# Altium schematic sheet STEP_MOTOR_DRIVER_2.SchDoc
size 420 x 297 mm; SheetNumber: 12; SheetTotal: 20
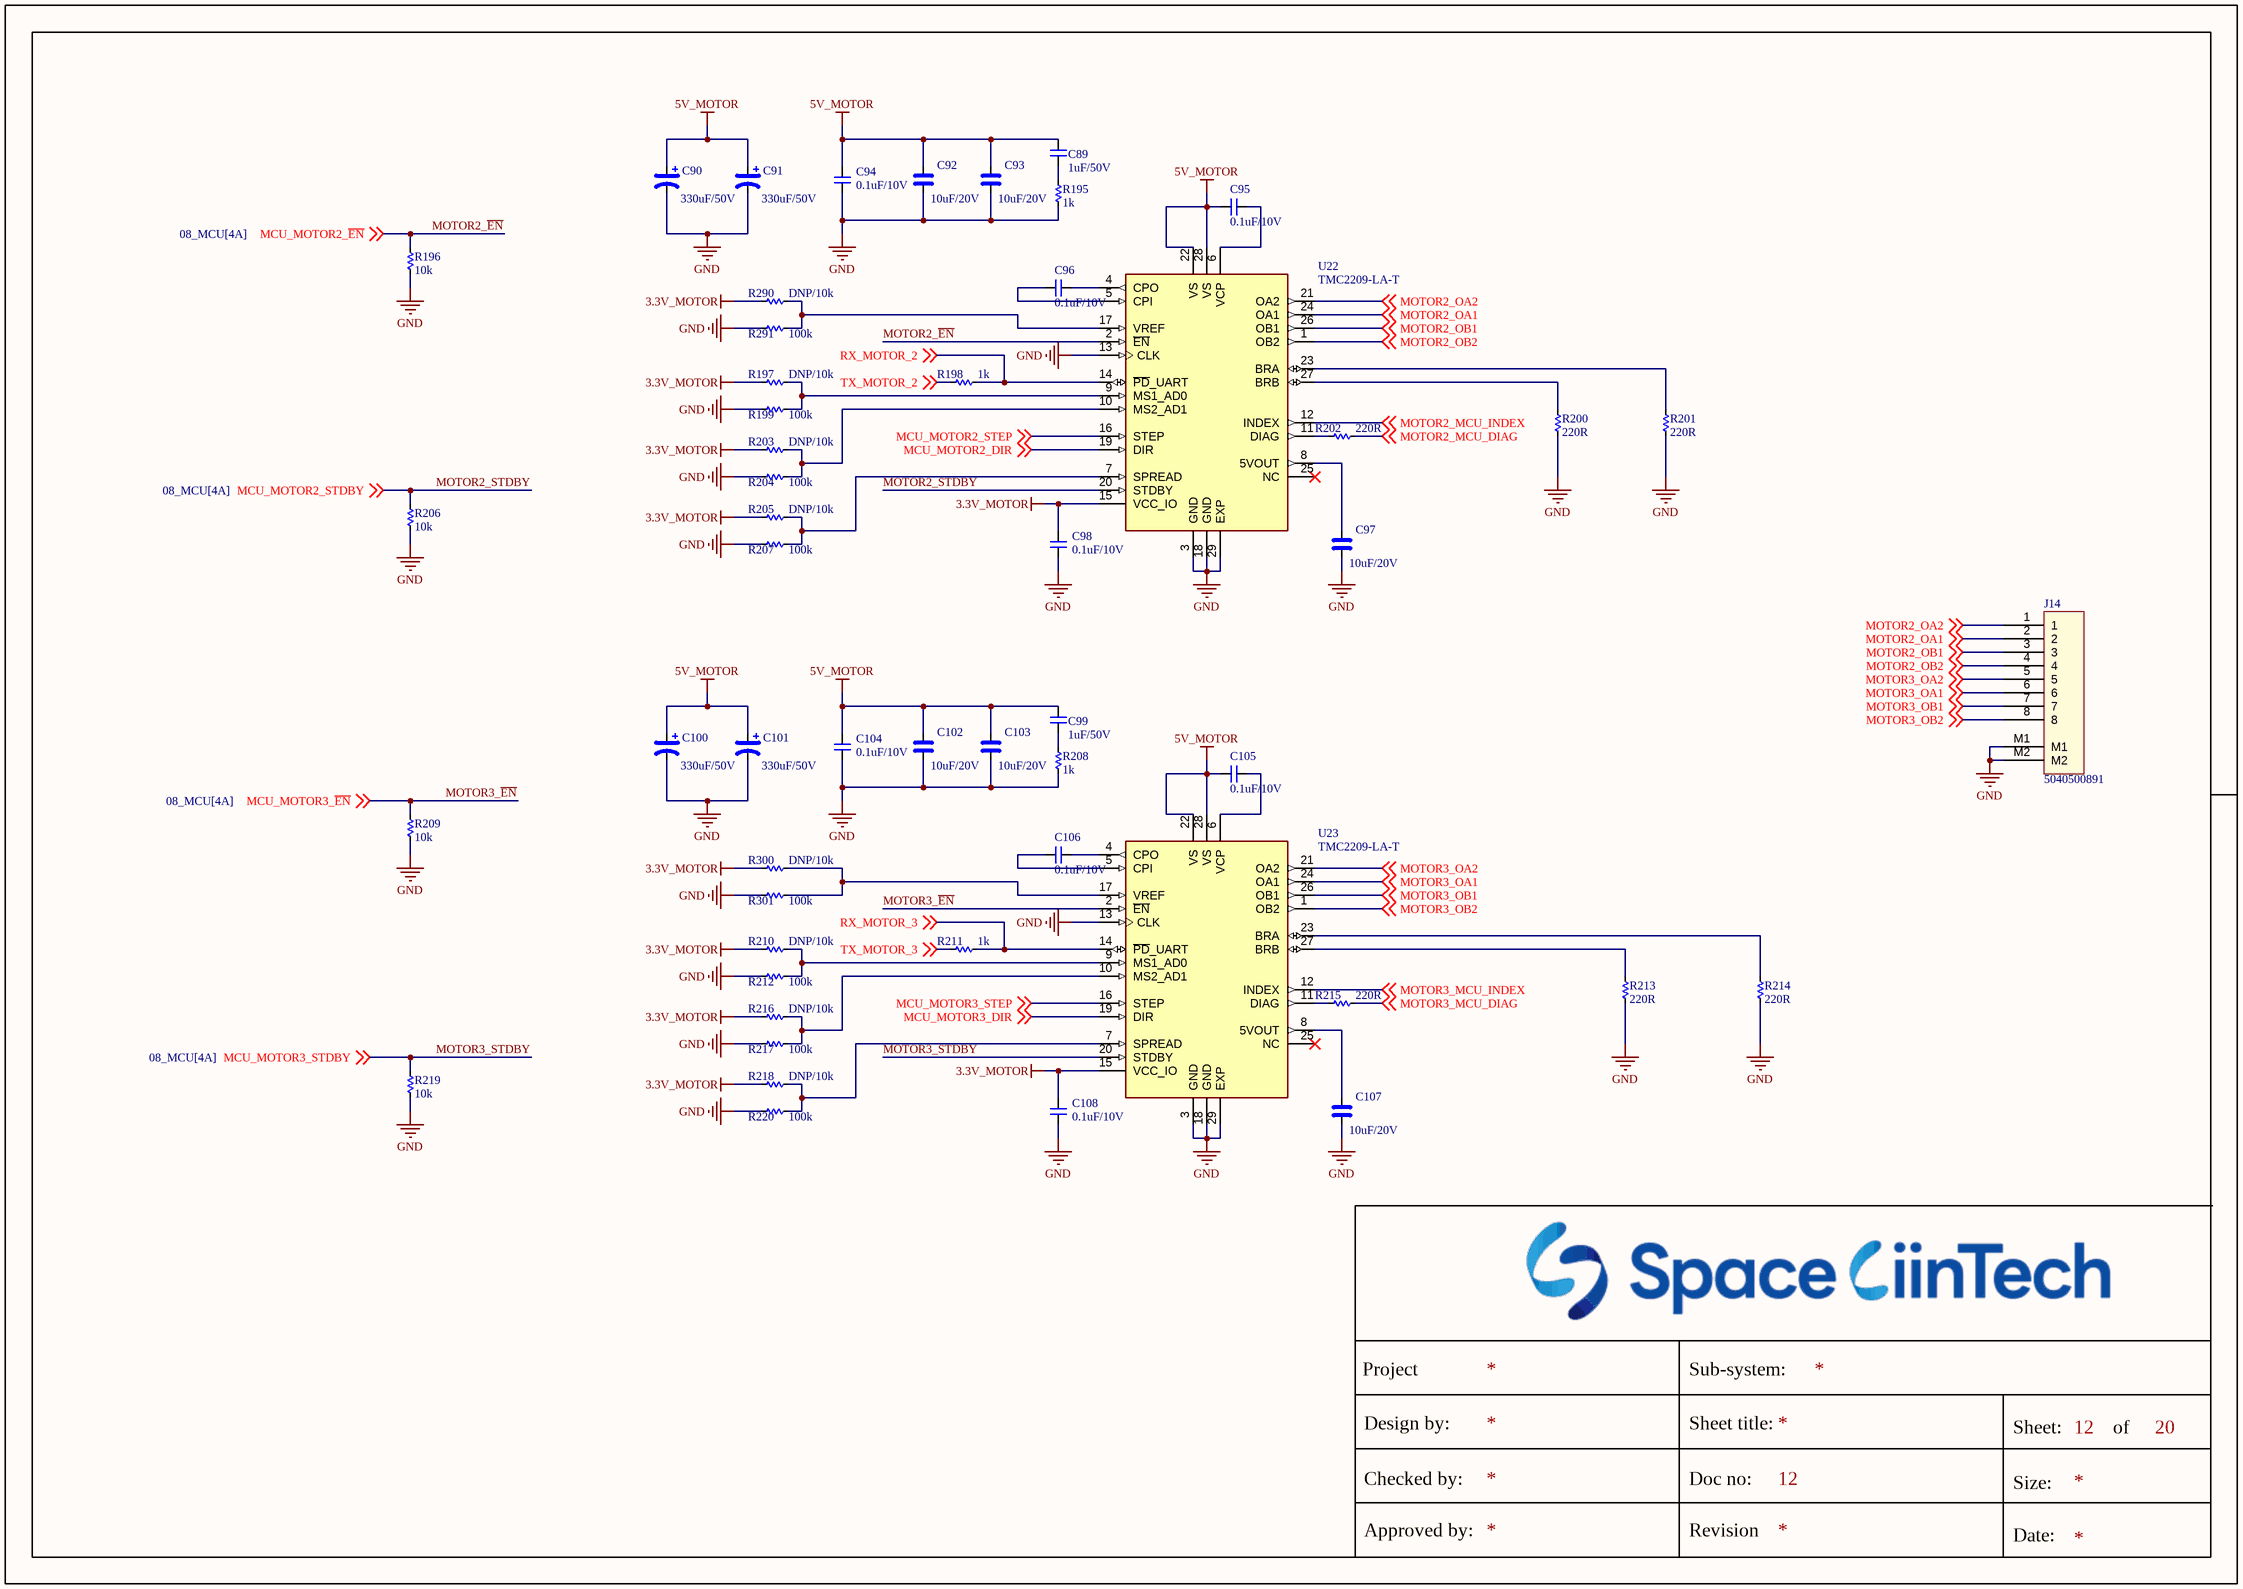
[diagram p0: STEP_MOTOR_DRIVER_2.SchDoc]

## Parts
C89  1uF/50V  [CAP_C_1005X50_L]
C90  330uF/50V  [CAP_MP_3216X180]
C91  330uF/50V  [CAP_MP_3216X180]
C92  10uF/20V  [CAP_C_2012X110]
C93  10uF/20V  [CAP_C_2012X110]
C94  0.1uF/10V  [CAP_C_1005X50_L]
C95  0.1uF/10V  [CAP_C_1005X50_L]
C96  0.1uF/10V  [CAP_C_1005X50_L]
C97  10uF/20V  [CAP_C_2012X110]
C98  0.1uF/10V  [CAP_C_1005X50_L]
C99  1uF/50V  [CAP_C_1005X50_L]
C100  330uF/50V  [CAP_MP_3216X180]
C101  330uF/50V  [CAP_MP_3216X180]
C102  10uF/20V  [CAP_C_2012X110]
C103  10uF/20V  [CAP_C_2012X110]
C104  0.1uF/10V  [CAP_C_1005X50_L]
C105  0.1uF/10V  [CAP_C_1005X50_L]
C106  0.1uF/10V  [CAP_C_1005X50_L]
C107  10uF/20V  [CAP_C_2012X110]
C108  0.1uF/10V  [CAP_C_1005X50_L]
J14  5040500891  [MOLEX_5040500891]
R195  1k  [RES_C_1005X40]
R196  10k  [RES_C_1005X40]
R197  DNP/10k  [RES_C_1005X40]
R198  1k  [RES_C_1005X40]
R199  100k  [RES_C_1005X40]
R200  220R  [RES_C_1005X40]
R201  220R  [RES_C_1005X40]
R202  220R  [RES_C_1005X40]
R203  DNP/10k  [RES_C_1005X40]
R204  100k  [RES_C_1005X40]
R205  DNP/10k  [RES_C_1005X40]
R206  10k  [RES_C_1005X40]
R207  100k  [RES_C_1005X40]
R208  1k  [RES_C_1005X40]
R209  10k  [RES_C_1005X40]
R210  DNP/10k  [RES_C_1005X40]
R211  1k  [RES_C_1005X40]
R212  100k  [RES_C_1005X40]
R213  220R  [RES_C_1005X40]
R214  220R  [RES_C_1005X40]
R215  220R  [RES_C_1005X40]
R216  DNP/10k  [RES_C_1005X40]
R217  100k  [RES_C_1005X40]
R218  DNP/10k  [RES_C_1005X40]
R219  10k  [RES_C_1005X40]
R220  100k  [RES_C_1005X40]
R290  DNP/10k  [RES_C_1005X40]
R291  100k  [RES_C_1005X40]
R300  DNP/10k  [RES_C_1005X40]
R301  100k  [RES_C_1005X40]
U22  TMC2209-LA-T  [QFN50P500X500X90-29N]
U23  TMC2209-LA-T  [QFN50P500X500X90-29N]

## Nets
3.3V_MOTOR: C98.2 C108.2 R197.2 R203.2 R205.2 R210.2 R216.2 R218.2 R290.2 R300.2 U22.15(VCC_IO) U23.15(VCC_IO)
5V_MOTOR: C89.2 C90.1 C91.1 C92.1 C93.1 C94.2 C95.2 C99.2 C100.1 C101.1 C102.1 C103.1 C104.2 C105.2 U22.22(VS) U22.28(VS) U23.22(VS) U23.28(VS)
GND: C90.2 C91.2 C92.2 C93.2 C94.1 C97.2 C98.1 C100.2 C101.2 C102.2 C103.2 C104.1 C107.2 C108.1 J14.M1 J14.M2 R195.1 R196.1 R199.2 R200.2 R201.2 R204.2 R206.1 R207.2 R208.1 R209.1 R212.2 R213.2 R214.2 R217.2 R219.1 R220.2 R291.2 R301.2 U22.3(GND) U22.13(CLK) U22.18(GND) U22.29(EXP) U23.3(GND) U23.13(CLK) U23.18(GND) U23.29(EXP)
MCU_MOTOR2_DIR: U22.19(DIR) ; off-sheet MCU_MOTOR2_DIR
MCU_MOTOR2_STEP: U22.16(STEP) ; off-sheet MCU_MOTOR2_STEP
MCU_MOTOR3_DIR: U23.19(DIR) ; off-sheet MCU_MOTOR3_DIR
MCU_MOTOR3_STEP: U23.16(STEP) ; off-sheet MCU_MOTOR3_STEP
MOTOR2_~{EN}: R196.2 U22.2(~{EN}) ; off-sheet MCU_MOTOR2_~{EN}  [also labelled MCU_MOTOR2_~{EN}]
MOTOR2_MCU_DIAG: R202.2 ; off-sheet MOTOR2_MCU_DIAG
MOTOR2_MCU_INDEX: U22.12(INDEX) ; off-sheet MOTOR2_MCU_INDEX
MOTOR2_OA1: J14.2 U22.24(OA1) ; off-sheet MOTOR2_OA1
MOTOR2_OA2: J14.1 U22.21(OA2) ; off-sheet MOTOR2_OA2
MOTOR2_OB1: J14.3 U22.26(OB1) ; off-sheet MOTOR2_OB1
MOTOR2_OB2: J14.4 U22.1(OB2) ; off-sheet MOTOR2_OB2
MOTOR2_STDBY: R206.2 U22.20(STDBY) ; off-sheet MCU_MOTOR2_STDBY  [also labelled MCU_MOTOR2_STDBY]
MOTOR3_~{EN}: R209.2 U23.2(~{EN}) ; off-sheet MCU_MOTOR3_~{EN}  [also labelled MCU_MOTOR3_~{EN}]
MOTOR3_MCU_DIAG: R215.2 ; off-sheet MOTOR3_MCU_DIAG
MOTOR3_MCU_INDEX: U23.12(INDEX) ; off-sheet MOTOR3_MCU_INDEX
MOTOR3_OA1: J14.6 U23.24(OA1) ; off-sheet MOTOR3_OA1
MOTOR3_OA2: J14.5 U23.21(OA2) ; off-sheet MOTOR3_OA2
MOTOR3_OB1: J14.7 U23.26(OB1) ; off-sheet MOTOR3_OB1
MOTOR3_OB2: J14.8 U23.1(OB2) ; off-sheet MOTOR3_OB2
MOTOR3_STDBY: R219.2 U23.20(STDBY) ; off-sheet MCU_MOTOR3_STDBY  [also labelled MCU_MOTOR3_STDBY]
RX_MOTOR_2: R198.2 U22.14(~{PD}_UART) ; off-sheet RX_MOTOR_2
RX_MOTOR_3: R211.2 U23.14(~{PD}_UART) ; off-sheet RX_MOTOR_3
TX_MOTOR_2: R198.1 ; off-sheet TX_MOTOR_2
TX_MOTOR_3: R211.1 ; off-sheet TX_MOTOR_3
NetC89_1: C89.1 R195.2
NetC95_1: C95.1 U22.6(VCP)
NetC96_1: C96.1 U22.4(CPO)
NetC96_2: C96.2 U22.5(CPI)
NetC97_1: C97.1 U22.8(5VOUT)
NetC99_1: C99.1 R208.2
NetC105_1: C105.1 U23.6(VCP)
NetC106_1: C106.1 U23.4(CPO)
NetC106_2: C106.2 U23.5(CPI)
NetC107_1: C107.1 U23.8(5VOUT)
NetR197_1: R197.1 R199.1 U22.9(MS1_AD0)
NetR200_1: R200.1 U22.27(BRB)
NetR201_1: R201.1 U22.23(BRA)
NetR202_1: R202.1 U22.11(DIAG)
NetR203_1: R203.1 R204.1 U22.10(MS2_AD1)
NetR205_1: R205.1 R207.1 U22.7(SPREAD)
NetR210_1: R210.1 R212.1 U23.9(MS1_AD0)
NetR213_1: R213.1 U23.27(BRB)
NetR214_1: R214.1 U23.23(BRA)
NetR215_1: R215.1 U23.11(DIAG)
NetR216_1: R216.1 R217.1 U23.10(MS2_AD1)
NetR218_1: R218.1 R220.1 U23.7(SPREAD)
NetR290_1: R290.1 R291.1 U22.17(VREF)
NetR300_1: R300.1 R301.1 U23.17(VREF)

Not connected (* = marked no-connect by the designer): U22 25(NC)*; U23 25(NC)*

## Notes on the sheet
- Project
- Sub-system:
- Design by:
- Sheet title:
- Sheet:
- of
- Checked by:
- Approved by:
- Doc no:
- Revision
- Size:
- Date:

## Library data of the parts
C89 C94-C96 C98 C99 C104-C106 C108 = _CAP_C_2: CAP
C90 C91 C100 C101 = _CAP_Pola_High_2: CAP Polarization High Value
C92 C93 C97 C102 C103 C107 = _CAP_C_High_2: CAP High Value
J14 = Header 8x1_2M
R195-R220 R290 R291 R300 R301 = _RES_B_2: RES
U22 U23 = TMC2209-LA-T: Bipolar Motor Driver Power MOSFET Step/Direction, UART 28-QFN (5x5); MF: Trinamic Motion Control GmbH; SnapEDA_Link: https://www.snapeda.com/parts/TMC2209-LA-T/Trinamic/view-part/?ref=snap; Package: VFQFN-28 Trinamic; Value: *; MP: TMC2209-LA-T; Check_prices: https://www.snapeda.com/parts/TMC2209-LA-T/Trinamic/view-part/?ref=eda